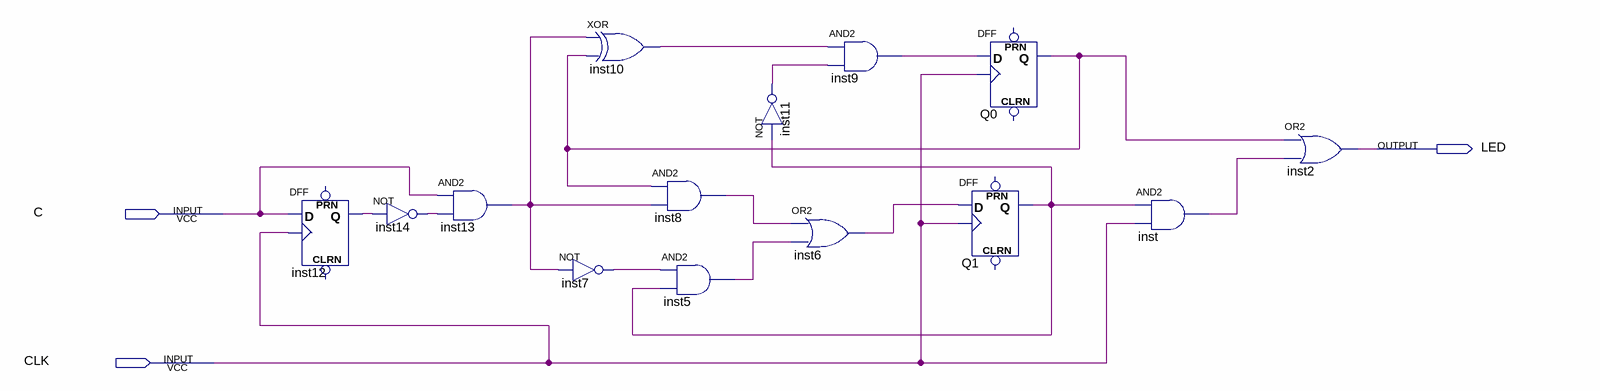
[diagram p0: schematic sheet]
// Quartus schematic ex1-statemachine.bdf as structural Verilog: 14 symbols, 3 pins
module \ex1-statemachine  (
  input  C,
  input  CLK,
  output LED
);

  wire inst5_out, inst6_out, inst7_out, inst8_out, inst9_out, inst10_out, inst11_out, inst12_q, inst13_out,
       inst14_out, inst_out, Q0_q, Q1_q;

  DFF inst12 (.CLK(CLK), .D(C), .Q(inst12_q));  // open: CLRN, PRN
  not inst14 (inst14_out, inst12_q);
  and inst13 (inst13_out, C, inst14_out);
  xor inst10 (inst10_out, inst13_out, Q0_q);
  not inst7 (inst7_out, inst13_out);
  and inst8 (inst8_out, Q0_q, inst13_out);
  and inst5 (inst5_out, inst7_out, Q1_q);
  not inst11 (inst11_out, Q1_q);
  or inst6 (inst6_out, inst8_out, inst5_out);
  and inst9 (inst9_out, inst10_out, inst11_out);
  DFF Q1 (.CLK(CLK), .D(inst6_out), .Q(Q1_q));  // open: CLRN, PRN
  DFF Q0 (.CLK(CLK), .D(inst9_out), .Q(Q0_q));  // open: CLRN, PRN
  and inst (inst_out, Q1_q, CLK);
  or inst2 (LED, Q0_q, inst_out);
endmodule
